# Altium schematic sheet ControlUnit.SchDoc
size A3
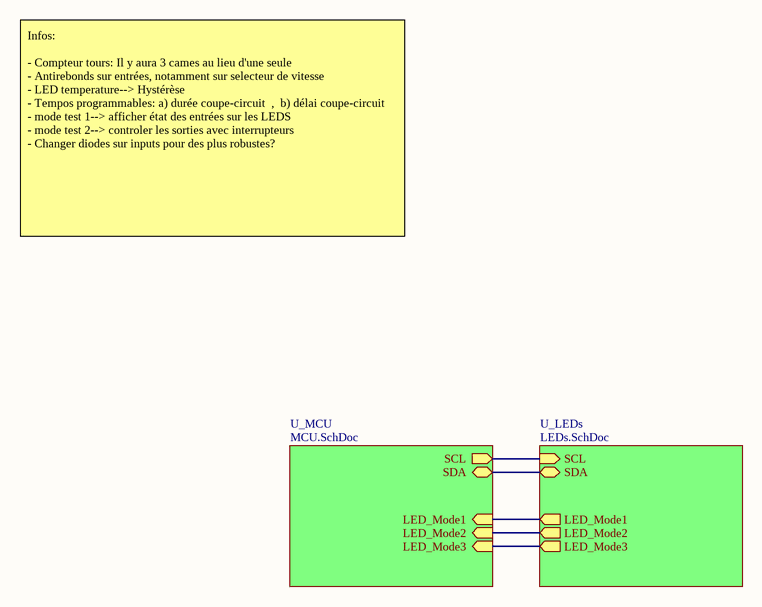
[diagram p0: ControlUnit.SchDoc]

## Sub-sheets
U_LEDs = LEDs.SchDoc: SCL (in), SDA (bidir), LED_Mode1 (out), LED_Mode2 (out), LED_Mode3 (out)
U_MCU = MCU.SchDoc: SCL (out), SDA (bidir), LED_Mode1 (in), LED_Mode2 (in), LED_Mode3 (in)

## Nets
(unnamed): sheet U_LEDs/SCL, sheet U_MCU/SCL
(unnamed): sheet U_LEDs/SDA, sheet U_MCU/SDA
(unnamed): sheet U_LEDs/LED_Mode1, sheet U_MCU/LED_Mode1
(unnamed): sheet U_LEDs/LED_Mode2, sheet U_MCU/LED_Mode2
(unnamed): sheet U_LEDs/LED_Mode3, sheet U_MCU/LED_Mode3

## Notes on the sheet
- Infos:
  - Compteur tours: Il y aura 3 cames au lieu d'une seule
  - Antirebonds sur entrées, notamment sur selecteur de vitesse
  - LED temperature--> Hystérèse
  - Tempos programmables: a) durée coupe-circuit  ,  b) délai coupe-circuit
  - mode test 1--> afficher état des entrées sur les LEDS
  - mode test 2--> controler les sorties avec interrupteurs
  - Changer diodes sur inputs pour des plus robustes?